# Altium schematic sheet SD_CARD.SchDoc
size A4
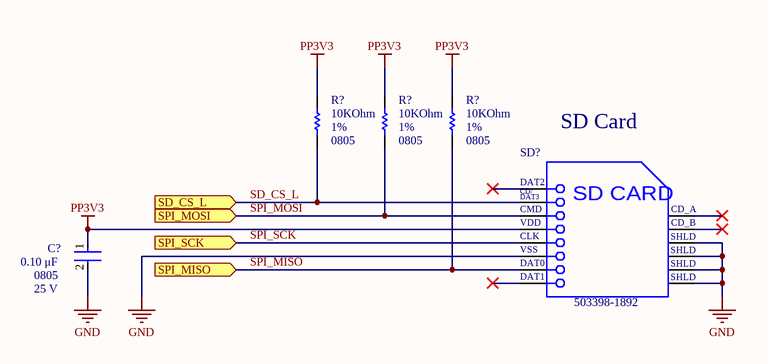
[diagram p0: SD_CARD.SchDoc]

## Parts
(Parts that share a designator on the sheet are numbered #1, #2 ... from top to bottom, then left to right.)
C?  Capacitance: 0.10 μF  Package: 0805  Voltage Rating: 25 V  [FP-C0805C-DN-MFG]  (hidden comment: C0805C104M3RACTU)
R?#1  value 10KOhm  PackageReference: 0805  Tolerance: 1%  [RESC2013X60X35NL10T20]  (hidden comment: RC0805FR-0710KL)
R?#2  value 10KOhm  PackageReference: 0805  Tolerance: 1%  [RESC2013X60X35NL10T20]  (hidden comment: RC0805FR-0710KL)
R?#3  value 10KOhm  PackageReference: 0805  Tolerance: 1%  [RESC2013X60X35NL10T20]  (hidden comment: RC0805FR-0710KL)
SD?  503398-1892  [MOLX-503398-1892_V]

## Ports
SD_CS_L (in), SPI_MISO (in), SPI_MOSI (in), SPI_SCK (in)

## Nets
GND: C?.2 SD?.6(VSS) SD?.11(SHLD) SD?.12(SHLD) SD?.13(SHLD) SD?.14(SHLD)
PP3V3: C?.1 R?#1.2 R?#2.2 R?#3.2 SD?.4(VDD)
SD_CS_L: R?#1.1 SD?.2(CD/DAT3) ; port SD_CS_L
SPI_MISO: R?#3.1 SD?.7(DAT0) ; port SPI_MISO
SPI_MOSI: R?#2.1 SD?.3(CMD) ; port SPI_MOSI
SPI_SCK: SD?.5(CLK) ; port SPI_SCK

Not connected (* = marked no-connect by the designer): SD? 1(DAT2)* 8(DAT1)* 9(CD_A)* 10(CD_B)*

## Notes on the sheet
- SD Card
- (in symbol CMP-2000-05621-1) CD/; DAT3; SD CARD

## Library data of the parts
C? = CMP-2007-00282-2: CAP CER 0.1UF 25V 20% X7R 0805; Manufacturer: KEMET; Temperature Coefficient: 30ppm/°C; Material: Ceramic; Tolerance: 0.2; Value: 0.10 μF; Digikey Description: CAP CER 0.1UF 25V 20% X7R 0805; Device Class L2: Capacitors; Temperature: -55°C to +125°C; Device Class L1: Passive Components; ComponentLink2Description: Datasheet; Mouser Description: Multilayer Ceramic Capacitors MLCC - SMD/SMT 25volts 0.1uF X7R 20%; Temperature Range High: +125°C; Device Class L3: Ceramic Capacitors; Automotive: No; Temperature Range Low: -55°C; RoHS: TRUE; Category: Cap; Lead Free: Yes; Ipc Land Pattern Name: CAPC200125X78; Height: 0.88mm; Temperature Characteristic: X7R; Octopart: https://octopart.com/c0805c104m3ractu-kemet-9138612; ComponentLink2URL: https://content.kemet.com/datasheets/KEM_C1003_C0G_SMD.pdf; Manufacturer Part Number: C0805C104M3RACTU; Supplier: Digi-Key; Supplier Part Number: 399-C0805C104M3RAC7800CT-ND
R?#1-R?#3 = CMP-1659-00013-4: Chip Resistor, 10 KOhm, +/- 1%, 0.125 W, -55 to 155 degC, 0805 (2012 Metric), RoHS, Tape and Reel; Manufacturer: Yageo; Voltage Rating: 150 V; Mount: Surface Mount; ComponentLink1Description: Manufacturer URL; ComponentLink2URL: http://www.yageo.com/documents/recent/PYu-RC_Group_51_RoHS_L_04.pdf; Pins: 2; Length: 2 mm; Min Operating Temperature: -55 degC; Height: 0.5 mm; Mounting Technology: Surface Mount; RoHSCompliant: true; REACH SVHC: No SVHC; ComponentLink1URL: http://www.yageo.com/; Max Operating Temperature: 155 degC; DatasheetVersion: Rev. 4, 02/2016; Package Quantity: 5000; Packaging: Tape and Reel; ComponentLink2Description: Datasheet; PackageDescription: 2-Pin Surface Mounted Device, Body 2 x 1.25 mm; Manufacturer Part Number: RC0805FR-0710KL; Supplier: Digi-Key; Supplier Part Number: RC0805FR-0710KL
SD? = CMP-2000-05621-1: Micro SD Connector, Pitch 1.1 mm, 8 Position, Height 1.4 mm, -25 to 85 degC, RoHS, Tape and Reel; Manufacturer: Molex; Manufacturer Part Number: 5033981892; Voltage Rating: 10VAC/DC; Current Rating: 500mA; Manufacturer URL: http://www.molex.com/; Package Reference: 503398-1892; Packaging: Reel; RoHS: Details; Brand: Molex; Datasheet URL: http://www.molex.com/pdm_docs/sd/5033981892_sd.pdf; Mounting Technology: SurfaceMount; Factory Pack Quantity: 2400; Datasheet Version: Rev. E, 04/2006; Series: 503398; Product Category: MemoryCardConnectors; Package Description: Micro SD Connector, Pitch 1.1 mm, 8 Position, Height 1.4 mm; Supplier: Digi-Key; Supplier Part Number: WM11190CT-ND